# Altium schematic sheet dcb_lite_logic.SchDoc
size A4; SheetNumber: 3; SheetTotal: 8
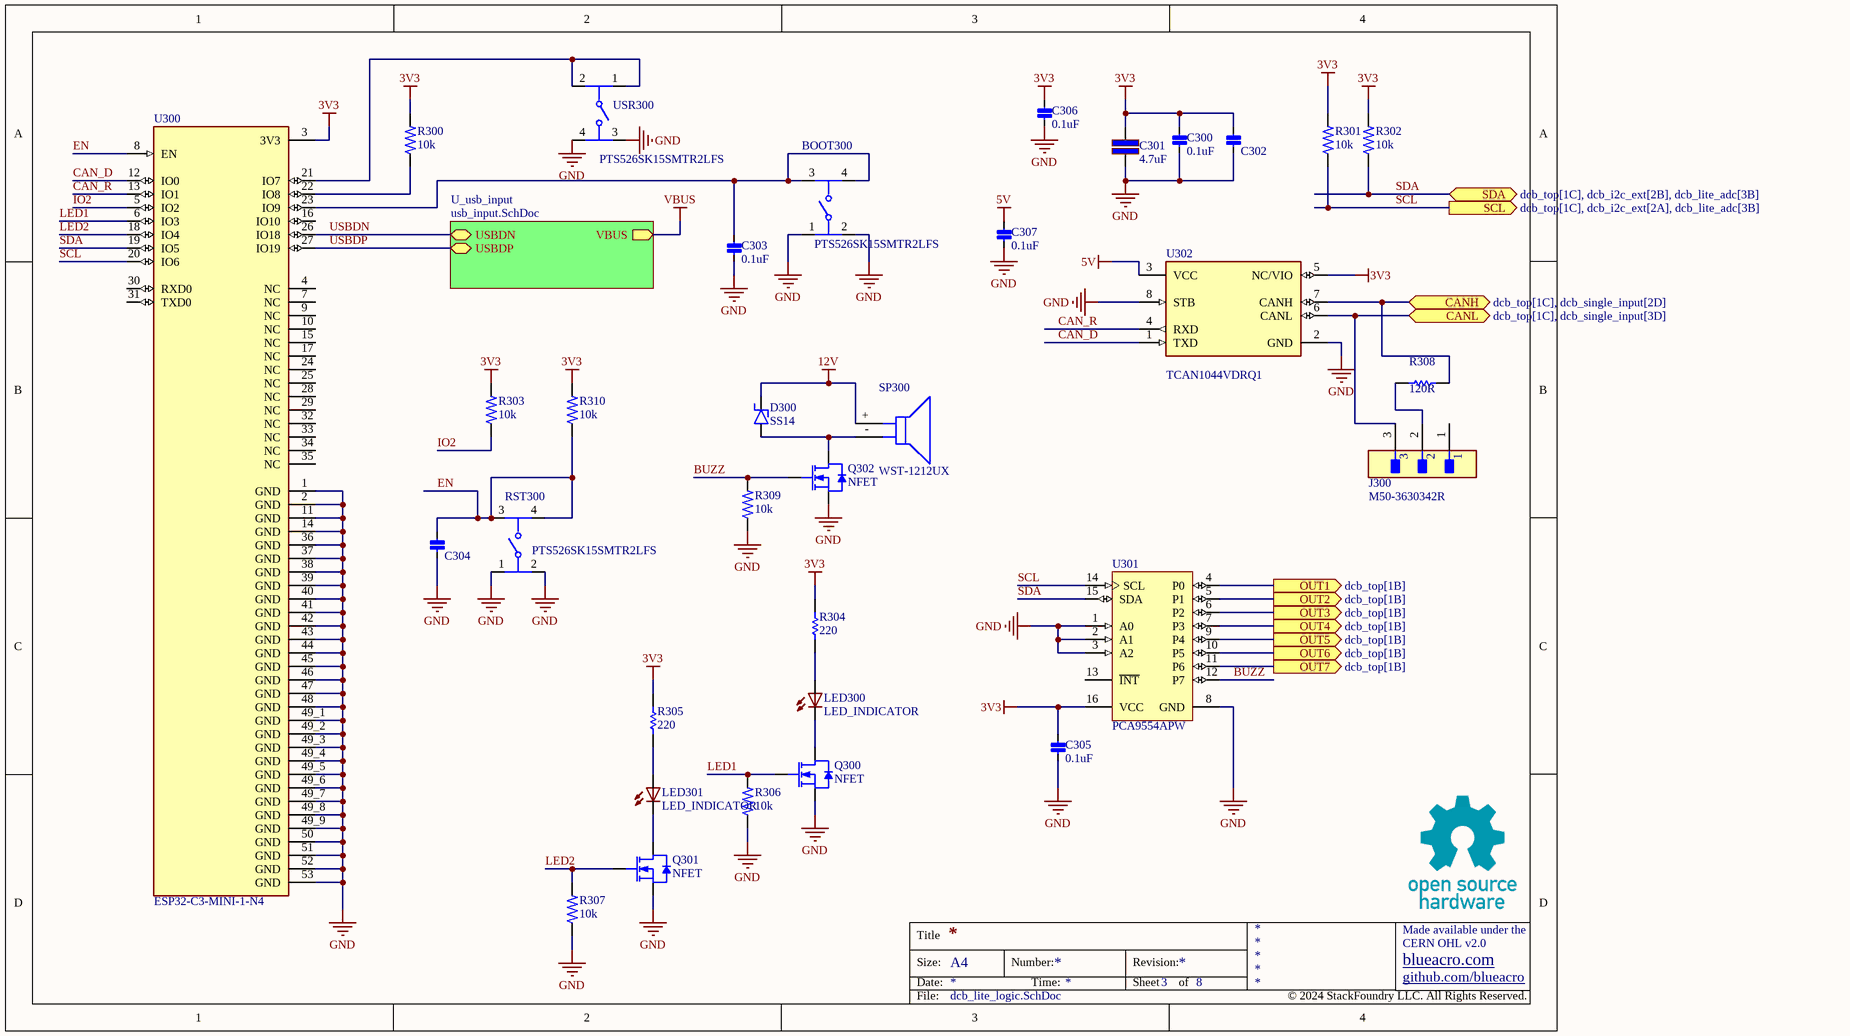
[diagram p0: dcb_lite_logic.SchDoc]

## Parts
BOOT300  PTS526SK15SMTR2LFS  [FP-PTS526SK15SMTR2LFS-MFG]
C300  value 0.1uF  [FP-CL10-IPC_B]  (hidden comment: CAP 0.1uF 50V X7R 0603)
C301  value 4.7uF  [CAPC3225X20N]  (hidden comment: CAP 4.7uF 50V X7R 1210)
C302  CAP 1uF 10V X7R 0603  [FP-CL10-IPC_B]  (value not drawn)
C303  value 0.1uF  [FP-CL10-IPC_B]  (hidden comment: CAP 0.1uF 50V X7R 0603)
C304  CAP 1uF 10V X7R 0603  [FP-CL10-IPC_B]  (value not drawn)
C305  value 0.1uF  [FP-CL10-IPC_B]  (hidden comment: CAP 0.1uF 50V X7R 0603)
C306  value 0.1uF  [FP-CL10-IPC_B]  (hidden comment: CAP 0.1uF 50V X7R 0603)
C307  value 0.1uF  [FP-CL10-IPC_B]  (hidden comment: CAP 0.1uF 50V X7R 0603)
D300  SS14  [SMA]
J300  M50-3630342R  [FP-M50-3630342R-MFG]
LED300  LED_INDICATOR  [LED5MM]
LED301  LED_INDICATOR  [LED5MM]
Q300  NFET  [SOT23-3]
Q301  NFET  [SOT23-3]
Q302  NFET  [SOT23-3]
R300  value 10k  [RESC1608-IPC-ML]  (hidden comment: 10K 0603 1%)
R301  value 10k  [RESC1608-IPC-ML]  (hidden comment: 10K 0603 1%)
R302  value 10k  [RESC1608-IPC-ML]  (hidden comment: 10K 0603 1%)
R303  value 10k  [RESC1608-IPC-ML]  (hidden comment: 10K 0603 1%)
R304  value 220  [RESC1608-IPC-ML]  (hidden comment: 220R 0603 5%)
R305  value 220  [RESC1608-IPC-ML]  (hidden comment: 220R 0603 5%)
R306  value 10k  [RESC1608-IPC-ML]  (hidden comment: 10K 0603 1%)
R307  value 10k  [RESC1608-IPC-ML]  (hidden comment: 10K 0603 1%)
R308  value 120R  [RESC3225X70X50LL20T20]  (hidden comment: 120R 1210 5%)
R309  value 10k  [RESC1608-IPC-ML]  (hidden comment: 10K 0603 1%)
R310  value 10k  [RESC1608-IPC-ML]  (hidden comment: 10K 0603 1%)
RST300  PTS526SK15SMTR2LFS  [FP-PTS526SK15SMTR2LFS-MFG]
SP300  WST-1212UX  [WST-1212UX-Footprint-1]
U300  ESP32-C3-MINI-1-N4  [XCVR_ESP32-C3-MINI-1-N4]
U301  PCA9554APW  [PW0016A_L]
U302  TCAN1044VDRQ1  [FP-D0008A-IPC_B]
USR300  PTS526SK15SMTR2LFS  [FP-PTS526SK15SMTR2LFS-MFG]

## Sub-sheets
U_usb_input = usb_input.SchDoc: USBDN (bidir), USBDP (bidir), VBUS (out)

## Ports
CANH (bidir, see dcb_top[1C], dcb_single_input[2D]), CANL (bidir, see dcb_top[1C], dcb_single_input[3D]), OUT1 (out, see dcb_top[1B]), OUT2 (out, see dcb_top[1B]), OUT3 (out, see dcb_top[1B]), OUT4 (out, see dcb_top[1B]), OUT5 (out, see dcb_top[1B]), OUT6 (out, see dcb_top[1B]), OUT7 (out, see dcb_top[1B]), SCL (out, see dcb_top[1C], dcb_i2c_ext[2A], dcb_lite_adc[3B]), SDA (bidir, see dcb_top[1C], dcb_i2c_ext[2B], dcb_lite_adc[3B])

## Nets
3V3: C300.1 C301.2 C302.1 C305.1 C306.1 R300.2 R301.2 R302.2 R303.2 R304.2 R305.2 R310.2 U300.3(3V3) U301.16(VCC) U302.5(NC/VIO)
5V: C307.1 U302.3(VCC)
12V: D300.K SP300.+
GND: BOOT300.1 BOOT300.2 C300.2 C301.1 C302.2 C303.2 C304.2 C305.2 C306.2 C307.2 Q300.2(S) Q301.2(S) Q302.2(S) R306.1 R307.1 R309.1 RST300.1 RST300.2 U300.1(GND) U300.2(GND) U300.11(GND) U300.14(GND) U300.36(GND) U300.37(GND) U300.38(GND) U300.39(GND) U300.40(GND) U300.41(GND) U300.42(GND) U300.43(GND) U300.44(GND) U300.45(GND) U300.46(GND) U300.47(GND) U300.48(GND) U300.49_1(GND) U300.49_2(GND) U300.49_3(GND) U300.49_4(GND) U300.49_5(GND) U300.49_6(GND) U300.49_7(GND) U300.49_8(GND) U300.49_9(GND) U300.50(GND) U300.51(GND) U300.52(GND) U300.53(GND) U301.1(A0) U301.2(A1) U301.3(A2) U301.8(GND) U302.2(GND) U302.8(STB) USR300.3 USR300.4
VBUS: sheet U_usb_input/VBUS
BUZZ: Q302.1(G) R309.2 U301.12(P7)
CAN_D: U300.12(IO0) U302.1(TXD)
CAN_R: U300.13(IO1) U302.4(RXD)
CANH: R308.2 U302.7(CANH) ; port CANH
CANL: J300.3 U302.6(CANL) ; port CANL
EN: C304.1 R310.1 RST300.3 RST300.4 U300.8(EN)
IO2: R303.1 U300.5(IO2)
LED1: Q300.1(G) R306.2 U300.6(IO3)
LED2: Q301.1(G) R307.2 U300.18(IO4)
OUT1: U301.4(P0) ; port OUT1
OUT2: U301.5(P1) ; port OUT2
OUT3: U301.6(P2) ; port OUT3
OUT4: U301.7(P3) ; port OUT4
OUT5: U301.9(P4) ; port OUT5
OUT6: U301.10(P5) ; port OUT6
OUT7: U301.11(P6) ; port OUT7
SCL: R301.1 U300.20(IO6) U301.14(SCL) ; port SCL
SDA: R302.1 U300.19(IO5) U301.15(SDA) ; port SDA
USBDN: U300.26(IO18) ; sheet U_usb_input/USBDN
USBDP: U300.27(IO19) ; sheet U_usb_input/USBDP
NetBOOT300_3: BOOT300.3 BOOT300.4 C303.1 U300.23(IO9)
NetD300_A: D300.A Q302.3(D) SP300.-
NetJ300_2: J300.2 R308.1
NetLED300_A: LED300.A R304.1
NetLED300_C: LED300.C Q300.3(D)
NetLED301_A: LED301.A R305.1
NetLED301_C: LED301.C Q301.3(D)
NetR300_1: R300.1 U300.22(IO8)
NetU300_21: U300.21(IO7) USR300.1 USR300.2

Not connected (* = marked no-connect by the designer): J300 1; U300 4(NC) 7(NC) 9(NC) 10(NC) 15(NC) 16(IO10) 17(NC) 24(NC) 25(NC) 28(NC) 29(NC) 30(RXD0) 31(TXD0) 32(NC) 33(NC) 34(NC) 35(NC); U301 13(~{INT})

## Notes on the sheet
- Title
- Size:
- Date:
- A4
- Number:
- Time:
- Revision:
- Sheet
- of
- github.com/blueacro
- blueacro.com
- CERN OHL v2.0
- Made available under the
- File:
- © 2024 StackFoundry LLC. All Rights Reserved.

## Library data of the parts
BOOT300 RST300 USR300 = CMP-011-00015-1: Switch Tactile N.O. SPST Round Button Gull Wing 0.05A 12VDC 200000Cycles 2.45N SMD T/R; Contact Current Rating: 50mA; Illumination Type: Non-Illuminated; Contact Resistance: 100mR; Number of Positions: 2; Switch Function: Off-Mom; Actuator Type: Standard; Operating Force: 260gf; Voltage Rating (DC): 12V; Ratings: IP40; Switch Travel: 0.25mm; Max Operating Temperature: 70°C; Mechanical Life: 200000Cycles; Termination: Gull Wing; Throw Configuration: SPST; Series: PTS526; Height: 1.65mm; Mounting Technology: Surface Mount; Min Operating Temperature: -20°C
C300 C303 C305-C307 = CMP-001-00084-7: Cap Ceramic 0.1uF 50V X7R 20% SMD 0603 125C Paper T/R; Voltage: 50V
C301 = CMP-001-00083-3: CAP CER 4.7UF 50V X7R 1210; Tolerance: 10%; Material: Ceramic; Voltage: 50V; Capacitance: 4.7uF; Width: 0.098inch; Height: 1.8mm; Depth: 2.5mm; Package Quantity: 1; Case/Package: 1210; Case Code (Imperial): 1210; Contact Plating: Tin; Thickness: 0.079inch; Radiation Hardening: No; Voltage Rating: 50V; Packaging: Tape and Reel; Lead Free: Lead Free; Dielectric: X7R; Min Operating Temperature: -55°C; Case Code (Metric): 3225; Max Operating Temperature: 125°C; Mount: Surface Mount; Length: 3.2mm
C302 C304 = CMP-001-00085-7: Cap Ceramic 1uF 10V X7R 10% SMD 0603 125C Paper T/R
D300 = CMP-080-0002-2: Source: diode.SCHLIB; Design Item ID: DIODE_SCHOTTKY
J300 = CMP-002-00105-2: 3 Pos. Male SIL Vertical SMT Conn. RoHS Compliant: Yes; Current Rating: 1A; Number of Positions: 3; Connector Type: Header; RoHS Compliant: Yes; Series: Archer M50; Fastening Type: Pull; Min Operating Temperature: -40°C; Termination: Solder; Contact Material: Brass; Mounting Technology: Surface Mount; Packaging: Cut Tape; Contact Finish - Mating: GOLD; Contact Shape: Square; Insulation Color: Black; Contact Type: Male Pin; Max Operating Temperature: 105°C; Flammability Rating: UL94 V-0; Insulation Material: Nylon; Number of Rows: 1
LED300 LED301 = CMP-130-0003-6: Source: led.SchLib; Design Item ID: LED_INDICATOR
Q300-Q302 = CMP-094-0000-1: Design Item ID: NFET; Source: fet.SchLib
R300-R303 R306 R307 R309 R310 = CMP-009-00191-4: Res General Purpose Thick Film 0603 10K Ohm 1% 1/10W ±100ppm/°C Molded SMD Paper T/R
R304 R305 = CMP-009-00183-3: YAGEO - RC0603JR-07220RL - SMD Chip Resistor, 0603 [1608 Metric], 220 ohm, RC Series, 75 V, Thick Film, 100 mW; Power Rating: 100mW; Working Voltage: 75V; Temperature Coefficient: 100ppm/°C; Voltage Rating (DC): 50V; Military Standard: Not; Resistance: 220R; Case Code (Metric): 1608; Max Operating Temperature: 155°C; Tolerance: 5%; Case/Package: 0603; REACH SVHC: No SVHC; Case Code (Imperial): 0603; Number of Terminations: 2; Termination: SMD/SMT; Min Operating Temperature: -55°C; Packaging: Tape and Reel; Resistor Type: Thick Film; Number of Pins: 2; Depth: 0.8mm; Voltage Rating: 50V; Width: 0.8mm; Lead Free: Lead Free; Length: 1.6mm
R308 = CMP-009-00240-1: SMD Chip Resistor, 120 Ohm, ± 5%, 500 mW, 1210 [3225 Metric], Thick Film, General Purpose; Voltage Rating: 200V; Power Rating: 500mW; Temperature Coefficient: 200ppm/°C; Tolerance: 5%; Case/Package: 1210; Mounting Technology: Surface Mount; Radiation Hardening: No; Reach SVHC Compliant: No; Military Standard: Not; Length: 3.2mm; Max Power Dissipation: 500mW; Max Operating Temperature: 155°C; RoHS Compliant: Yes; Series: ERJ; Height: 0.6mm; Construction: Rectangular; Termination: SMD/SMT; Case Code (Metric): 3225; Width: 2.5mm; Package Quantity: 1; Packaging: Tape and Reel; Technology: THICK FILM; Number of Terminations: 2; Case Code (Imperial): 1210; Depth: 2.5mm; Features: Automotive AEC-Q200; Contact Plating: Tin; Resistance Tolerance: 5%; Voltage Rating (DC): 200V; Min Operating Temperature: -55°C; Resistor Type: Thick Film
SP300 = CMP-00027-00003-3: Audio Magnetic Xdcr 9-15V Th; Frequency: 2.3kHz; Mounting Technology: Through Hole; Min Operating Temperature: -20°C; Max Operating Temperature: 60°C
U300 = CMP-206-000000-1: Bluetooth, WiFi 802.11b/g/n, Bluetooth v5.0 Transceiver Module 2.412GHz ~ 2.484GHz PCB Trace Surface Mount; MF: Espressif Systems; Availability: In Stock; Purchase-URL: https://pricing.snapeda.com/search/part/ESP32-C3-MINI-1-N4/?ref=eda; MP: ESP32-C3-MINI-1-N4; Source: ESP32-C3-MINI-1-N4.SchLib; Check_prices: https://www.snapeda.com/parts/ESP32-C3-MINI-1-N4/Espressif+Systems/view-part/?ref=eda; Pin Count: 61; Design Item ID: ESP32-C3-MINI-1-N4; Price: None; Component Type: Standard; Package: SMD-53 Espressif Systems; SnapEDA_Link: https://www.snapeda.com/parts/ESP32-C3-MINI-1-N4/Espressif+Systems/view-part/?ref=snap; Value: *
U301 = CMP-015-00016-1: I2C/SMBus Interface 100kHz/400kHz 5.5V 16-Pin TSSOP Tube / IC I/O EXPANDER I2C 8B 16TSSOP; Number of Outputs: 8; Output Type: PUSH-PULL; Clock Frequency: 400kHz; Operating Supply Current: 104uA; Pins: 16; Operating Supply Voltage: 5.5V; Case/Package: TSSOP; Packaging: Rail/Tube; Weight: 0.002183oz; Lead Free: Lead Free; Radiation Hardening: No; Thickness: 1mm; Number of I/Os: 8; Length: 5mm; Max Operating Temperature: 85°C; Width: 4.4mm; RoHS Compliant: Yes; Height: 1.2mm; Series: -; Frequency: 400kHz; Min Operating Temperature: -40°C
U302 = CMP-015-00017-1: R-PDSO-G8 TCAN1044 Tape & Reel (TR) CAN interface transceiver 100mV 4.905mm 5Mbps -40C~125C TA; Min Supply Voltage: 4.5V; Max Supply Voltage: 5.5V; Min Operating Temperature: -40°C; Data Rate: 5Mbps; Series: Automotive, AEC-Q100; RoHS Compliant: Yes; Max Operating Temperature: 125°C; Length: 4.9mm; Pins: 8; Thickness: 1.58mm; Height: 1.75mm; Width: 3.91mm; Case/Package: SOIC; Mounting Technology: Surface Mount; Interface: CAN; Receiver Hysteresis: 100mV